# EasyEDA schematic RPI Pico Breakout_2021-05-18.json
TITLE: Sheet_1; REV: 1.0; Date: 2021-05-16; Sheet: 1/1; Drawn By: M Aitesam; Company: Your Company
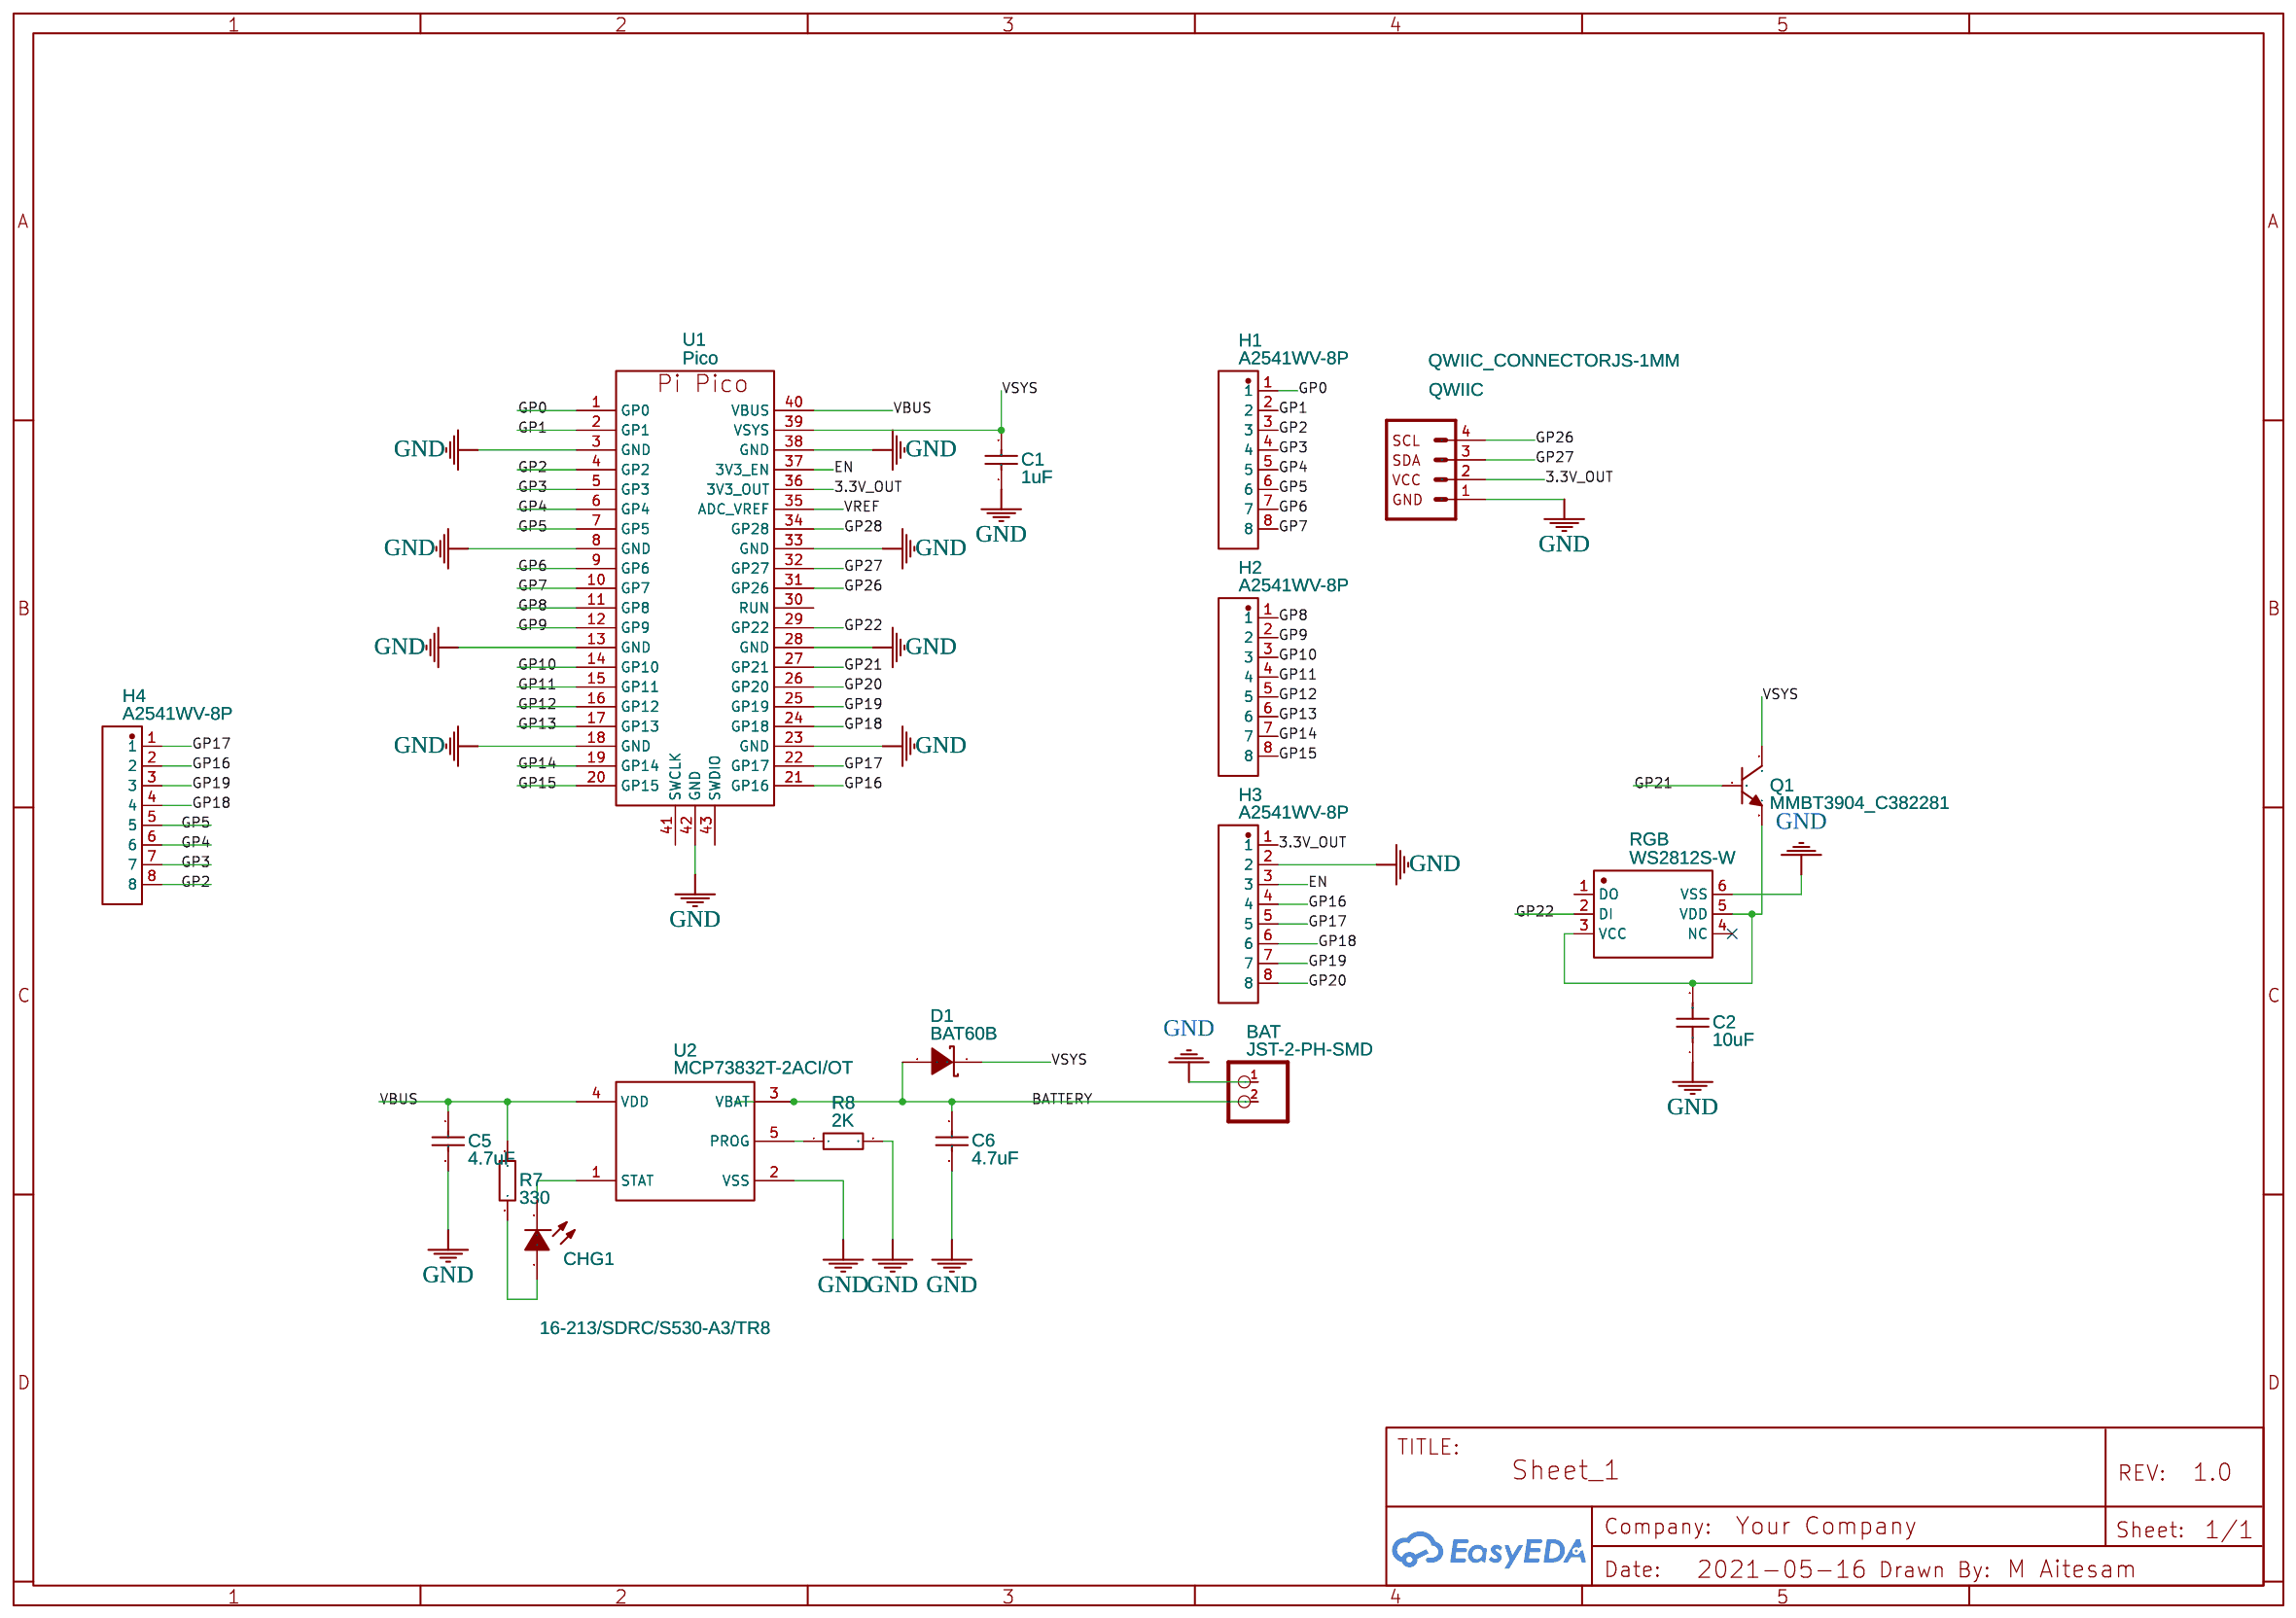
[diagram p0: schematic sheet]

## Parts
BAT  JST-2-PH-SMD  [JST-PH2-SMD]
C1  1uF  [C0402]
C2  10uF  [C0603]
C5  4.7uF  [C0805]
C6  4.7uF  [C0805]
CHG1  16-213/SDRC/S530-A3/TR8  [LED0402-RD]
D1  BAT60B  [SOD-323_L1.8-W1.3-LS2.5-RD]
H1  A2541WV-8P  [HDR-TH_8P-P2.54-V-M]
H2  A2541WV-8P  [HDR-TH_8P-P2.54-V-M]
H3  A2541WV-8P  [HDR-TH_8P-P2.54-V-M]
H4  A2541WV-8P  [HDR-TH_8P-P2.54-V-M]
Q1  MMBT3904_C382281  [SOT-23-3_L3.0-W1.7-P0.95-LS2.9-BR]
QWIIC  QWIIC_CONNECTORJS-1MM  [JST04_1MM_RA]
R7  330  [R0402]
R8  2K  [R0402]
RGB  WS2812S-W  [LED-SMD_6P-L5.0-W5.0-TL]
U1  Pico  [RASPBERRY_PI_PICO_CASTELLATED]
U2  MCP73832T-2ACI/OT  [SOT-23-5_L3.0-W1.7-P0.95-LS2.8-BR]

## Library data of the parts
BAT = JST-2-PH-SMD: Contributor: vosegaard
C1 = CL05A105KP5NNNC: Supplier: LCSC; Manufacturer: SAMSUNG; Supplier Part: C14445; JLCPCB Part Class: Extended Part
C2 = CL10A106KP8NNNC: Supplier: LCSC; Manufacturer: SAMSUNG; Supplier Part: C19702; JLCPCB Part Class: Basic Part
C5 C6 = CL21A475KAQNNNE: Supplier: LCSC; Manufacturer: SAMSUNG; Supplier Part: C1779; JLCPCB Part Class: Basic Part
CHG1 = 16-213/SDRC/S530-A3/TR8: Supplier: LCSC; Manufacturer: EVERLIGHT; image: //image.lceda.cn/szlcsc/C71911.jpg; Supplier Part: C71911; JLCPCB Part Class: Extended Part
D1 = BAT60B: Supplier: LCSC; Manufacturer: CJ; image: //image.lceda.cn/szlcsc/C22638.jpg; Supplier Part: C22638; JLCPCB Part Class: Extended Part
H1-H4 = A2541WV-8P: Supplier: LCSC; Supplier Part: C225483; Manufacturer: Changjiang Connectors; Contributor: LCSC; JLCPCB Part Class: Extended Part
Q1 = MMBT3904_C382281: Supplier: LCSC; Supplier Part: C382281; Manufacturer: KEXIN; Manufacturer Part: MMBT3904; Contributor: LCSC; JLCPCB Part Class: Extended Part
QWIIC = QWIIC_CONNECTORJS-1MM: Contributor: Rahul Singh
R7 = 0402WGJ0331TCE: Supplier: LCSC; Manufacturer: UniOhm; Supplier Part: C12246; JLCPCB Part Class: Extended Part
R8 = 0402WGF2001TCE: Supplier: LCSC; Manufacturer: UniOhm; Supplier Part: C4109; JLCPCB Part Class: Basic Part
RGB = WS2812S-W: Supplier: LCSC; Manufacturer: Worldsemi; Contributor: LCSC; Supplier Part: C114584; JLCPCB Part Class: Extended Part
U1 = Pico: Manufacturer: Raspberry Pi Foundation; Manufacturer Part: Pi Pico; Supplier: Raspberry Pi; Supplier Part: Pi Pico; link: https://datasheets.raspberrypi.org/pico/pico_datasheet.pdf; Contributor: TomPilot
U2 = MCP73832T-2ACI/OT: Supplier: LCSC; Manufacturer: MICROCHIP; image: //image.lceda.cn/szlcsc/C38066.jpg; Supplier Part: C38066; JLCPCB Part Class: Extended Part

## Nets
3.3V_OUT: H3.1 QWIIC.2 U1.36(3V3_OUT)
GND: BAT.1(-) C1.1 C2.1 C5.1 C6.1 H3.2 QWIIC.1 R8.2 RGB.6(VSS) U1.3(GND) U1.8(GND) U1.13(GND) U1.18(GND) U1.23(GND) U1.28(GND) U1.33(GND) U1.38(GND) U1.42(GND) U2.2(VSS)
VBUS: C5.2 R7.1 U1.40(VBUS) U2.4(VDD)
BATTERY: BAT.2(+) C6.2 D1.2(A) U2.3(VBAT)
EN: H3.3 U1.37(3V3_EN)
GP0: H1.1 U1.1(GP0)
GP1: H1.2 U1.2(GP1)
GP2: H1.3 H4.8 U1.4(GP2)
GP3: H1.4 H4.7 U1.5(GP3)
GP4: H1.5 H4.6 U1.6(GP4)
GP5: H1.6 H4.5 U1.7(GP5)
GP6: H1.7 U1.9(GP6)
GP7: H1.8 U1.10(GP7)
GP8: H2.1 U1.11(GP8)
GP9: H2.2 U1.12(GP9)
GP10: H2.3 U1.14(GP10)
GP11: H2.4 U1.15(GP11)
GP12: H2.5 U1.16(GP12)
GP13: H2.6 U1.17(GP13)
GP14: H2.7 U1.19(GP14)
GP15: H2.8 U1.20(GP15)
GP16: H3.4 H4.2 U1.21(GP16)
GP17: H3.5 H4.1 U1.22(GP17)
GP18: H3.6 H4.4 U1.24(GP18)
GP19: H3.7 H4.3 U1.25(GP19)
GP20: H3.8 U1.26(GP20)
GP21: Q1.1(B) U1.27(GP21)
GP22: RGB.2(DI) U1.29(GP22)
GP26: QWIIC.4 U1.31(GP26)
GP27: QWIIC.3 U1.32(GP27)
GP28: U1.34(GP28)
VREF: U1.35(ADC_VREF)
VSYS: C1.2 D1.1(K) Q1.3(C) U1.39(VSYS)
Net-(C2-2): C2.2 Q1.2(E) RGB.3(VCC) RGB.5(VDD)
Net-(CHG1-1): CHG1.1(-) U2.1(STAT)
Net-(CHG1-2): CHG1.2(+) R7.2
Net-(R8-1): R8.1 U2.5(PROG)

Not connected (* = marked no-connect by the designer): RGB 1(DO) 4(NC)*; U1 30(RUN) 41(SWCLK) 43(SWDIO)
